# Altium schematic sheet hv_bleed.SchDoc
size A
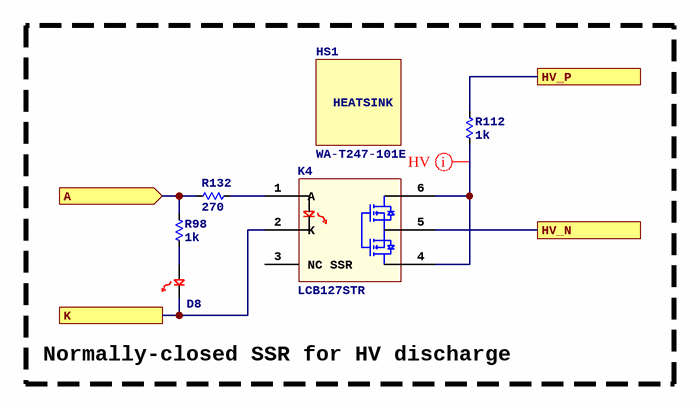
[diagram p0: hv_bleed.SchDoc]

## Parts
D8  LTST-C190KRKT  [LED_0603P_RED]  (value not drawn)
HS1  WA-T247-101E  [OHMITE_WA-T247-101E]
K4  LCB127STR  [6SMD300]
R98  value 1k  [R0402]  (hidden comment: 0402WGF1001TCE)
R112  value 1k  [TO-247-2_VERTICAL]  (hidden comment: TEH100M1K00JE)
R132  value 270  [R0402]  (hidden comment: 0402WGF2700TCE)

## Blocks framed on the sheet
Normally-closed SSR for HV discharge: D8 HS1 K4 R98 R112 R132

## Ports
A (in), HV_N, HV_P, K

## Nets
A: R98.1 R132.2 ; port A
HV_N: K4.5 ; port HV_N
HV_P: R112.2 ; port HV_P
K: D8.2 K4.2(K) ; port K
NetD8_1: D8.1 R98.2
NetK4_1: K4.1(A) R132.1
NetK4_4: K4.4 K4.6 R112.1

Not connected (* = marked no-connect by the designer): K4 3

## Layout directives
net class HV: NetK4_4

## Notes on the sheet
- (in symbol LCB127STR) NC SSR
- (in symbol WA-T247-101E) HEATSINK

## Library data of the parts
D8 = LTST-C190KRKT: LED SUPER RED CLEAR 0603 SMD; Manufacturer: Lite-On Inc; Vf: 2.0 V; If: 20 mA; Supplier 1: DigiKey; ComponentLink1URL: https://optoelectronics.liteon.com/upload/download/DS-22-99-0151/LTST-C190KRKT.pdf; ComponentLink1Description: Datasheet; Supplier Part Number 1: 160-1436-1-ND; Manufacturer Part Number: LTST-C190KRKT; Supplier 2: LCSC; Supplier Part Number 2: C94869; LED Color: Red; Supplier 3: Mouser; Supplier Part Number 3: 859-LTST-C190KRKT
HS1 = WA-T247-101E: Heat Sink, 11ohm, Extruded, Clip, Longitudinal, Aluminum Alloy, Anodized; Manufacturer: Ohmite; Supplier 1: DigiKey; Supplier Part Number 1: WA-T247-101E-ND; Manufacturer Part Number: WA-T247-101E; ComponentLink1Description: Datasheet; ComponentLink1URL: https://www.ohmite.com/assets/images/sink-w.pdf; Supplier 3: Mouser; Supplier Part Number 3: 588-WA-T247-101E
K4 = LCB127STR: Relay Ssr 50MA 1.4V Dc-in 0.2A 250V Ac/dc-out 6-PIN PDIP SMD T/r; Manufacturer: IXYS; Supplier 1: DigiKey; Supplier Part Number 1: 212-LCB127STRCT-ND; Manufacturer Part Number: LCB127STR; ComponentLink1Description: Datasheet; ComponentLink1URL: https://www.littelfuse.com/assetdocs/littelfuse-integrated-circuits-lcb127-datasheet?assetguid=ed9c03ce-9d8a-4952-b2f0-cdedc4b0af1f; Supplier 2: LCSC; Supplier Part Number 2: C6286119; Supplier 3: Mouser; Supplier Part Number 3: 849-LCB127STR
R98 = 0402WGF1001TCE: Manufacturer: UNI-ROYAL(Uniroyal Elec); Tolerance: 1%; Temperature Coefficient: ±100ppm/?; Power Rating (mW): 62.5; ComponentLink1Description: Datasheet; ComponentLink1URL: https://wmsc.lcsc.com/wmsc/upload/file/pdf/v2/lcsc/2206010216_UNI-ROYAL-Uniroyal-Elec-0402WGF1001TCE_C11702.pdf; Manufacturer Part Number: 0402WGF1001TCE; Package: 0402; Supplier 2: LCSC; Supplier Part Number 2: C11702
R112 = TEH100M1K00JE: Manufacturer: Ohmite; Tolerance: 5%; Power Rating (mW): 100000; Supplier 1: DigiKey; Manufacturer Part Number: TEH100M1K00JE; ComponentLink1URL: http://www.ohmite.com/cat/res_teh100.pdf; ComponentLink1Description: Datasheet; Supplier Part Number 1: TEH100M1K00JE-ND; Supplier 2: LCSC; Supplier Part Number 2: C2642397; Package: TO-247
R132 = 0402WGF2700TCE: Manufacturer: UNI-ROYAL(Uniroyal Elec); Tolerance: 1%; Temperature Coefficient: ±100ppm/?; Power Rating (mW): 62.5; ComponentLink1Description: Datasheet; ComponentLink1URL: https://wmsc.lcsc.com/wmsc/upload/file/pdf/v2/lcsc/2205311900_UNI-ROYAL-Uniroyal-Elec-0402WGF2700TCE_C25099.pdf; Manufacturer Part Number: 0402WGF2700TCE; Package: 0402; Supplier 2: LCSC; Supplier Part Number 2: C25099